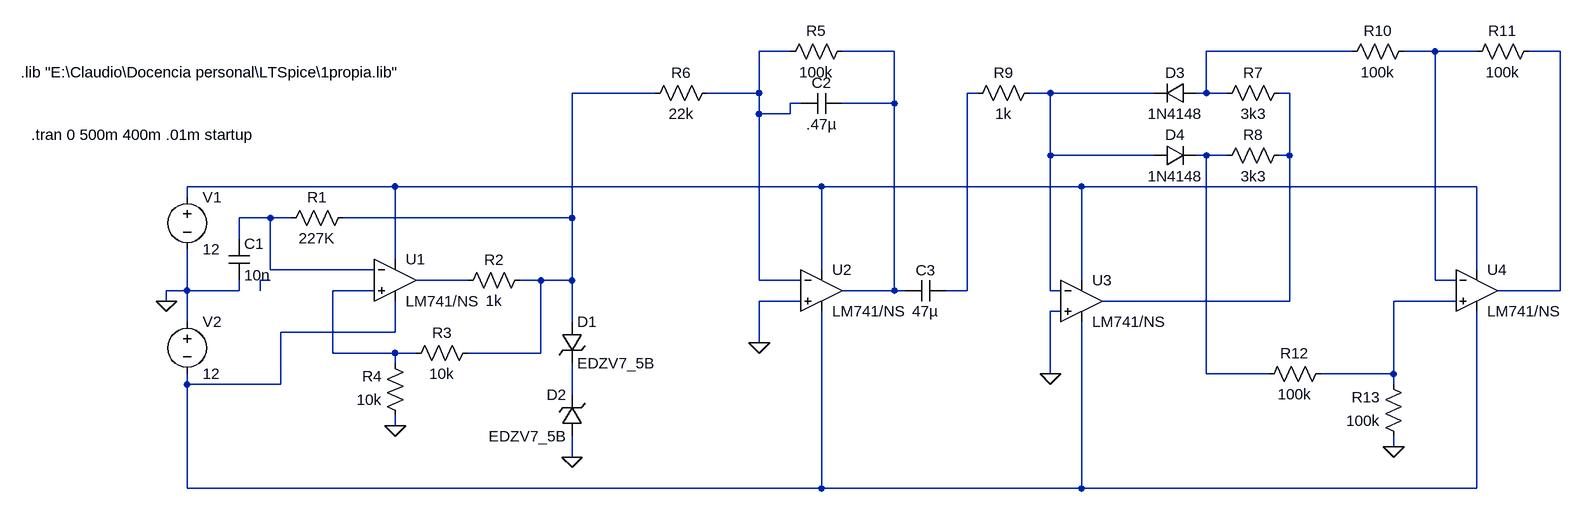
[diagram p0: schematic lab_amp_opx.asc]
lab_amp_opx.asc, the LTspice schematic file:
Version 4
SHEET 1 2016 680
WIRE 816 -176 768 -176
WIRE 976 -176 896 -176
WIRE 1680 -176 1456 -176
WIRE 1808 -176 1760 -176
WIRE 1872 -176 1808 -176
WIRE 2000 -176 1952 -176
WIRE 608 -112 480 -112
WIRE 768 -112 768 -176
WIRE 768 -112 688 -112
WIRE 1104 -112 1088 -112
WIRE 1216 -112 1184 -112
WIRE 1376 -112 1216 -112
WIRE 1456 -112 1456 -176
WIRE 1456 -112 1440 -112
WIRE 1488 -112 1456 -112
WIRE 1584 -112 1568 -112
WIRE 832 -96 816 -96
WIRE 976 -96 976 -176
WIRE 976 -96 896 -96
WIRE 768 -80 768 -112
WIRE 816 -80 816 -96
WIRE 816 -80 768 -80
WIRE 1216 -16 1216 -112
WIRE 1376 -16 1216 -16
WIRE 1456 -16 1440 -16
WIRE 1488 -16 1456 -16
WIRE 1584 -16 1584 -112
WIRE 1584 -16 1568 -16
WIRE 208 32 -112 32
WIRE 864 32 208 32
WIRE 1264 32 864 32
WIRE 1872 32 1264 32
WIRE -112 48 -112 32
WIRE 16 80 -32 80
WIRE 48 80 16 80
WIRE 480 80 480 -112
WIRE 480 80 128 80
WIRE -32 112 -32 80
WIRE 208 144 208 32
WIRE 16 160 16 80
WIRE 176 160 16 160
WIRE 864 160 864 32
WIRE 1872 160 1872 32
WIRE 16 176 0 176
WIRE 320 176 240 176
WIRE 432 176 400 176
WIRE 480 176 480 80
WIRE 480 176 432 176
WIRE 768 176 768 -80
WIRE 832 176 768 176
WIRE 1264 176 1264 32
WIRE 1808 176 1808 -176
WIRE 1840 176 1808 176
WIRE -112 192 -112 128
WIRE -112 192 -144 192
WIRE -32 192 -32 176
WIRE -32 192 -112 192
WIRE 0 192 0 176
WIRE 176 192 112 192
WIRE 976 192 976 -96
WIRE 976 192 896 192
WIRE 992 192 976 192
WIRE 1088 192 1088 -112
WIRE 1088 192 1056 192
WIRE 1216 192 1216 -16
WIRE 1232 192 1216 192
WIRE 2000 192 2000 -176
WIRE 2000 192 1904 192
WIRE -144 208 -144 192
WIRE 832 208 768 208
WIRE 1584 208 1584 -16
WIRE 1584 208 1296 208
WIRE 1840 208 1744 208
WIRE 1232 224 1216 224
WIRE -112 240 -112 192
WIRE 480 240 480 176
WIRE 208 256 208 208
WIRE 208 256 32 256
WIRE 768 272 768 208
WIRE 112 288 112 192
WIRE 208 288 112 288
WIRE 240 288 208 288
WIRE 432 288 432 176
WIRE 432 288 320 288
WIRE 208 304 208 288
WIRE 1216 320 1216 224
WIRE 1456 320 1456 -16
WIRE 1552 320 1456 320
WIRE 1744 320 1744 208
WIRE 1744 320 1632 320
WIRE -112 336 -112 320
WIRE 32 336 32 256
WIRE 32 336 -112 336
WIRE 1744 336 1744 320
WIRE 480 352 480 304
WIRE 208 400 208 384
WIRE 1744 432 1744 416
WIRE 480 448 480 416
WIRE -112 496 -112 336
WIRE 864 496 864 224
WIRE 864 496 -112 496
WIRE 1264 496 1264 240
WIRE 1264 496 864 496
WIRE 1872 496 1872 224
WIRE 1872 496 1264 496
FLAG -144 208 0
FLAG 208 400 0
FLAG 480 448 0
FLAG 768 272 0
FLAG 1216 320 0
FLAG 1744 432 0
SYMBOL voltage -112 32 R0
WINDOW 123 0 0 Left 2
WINDOW 39 0 0 Left 2
SYMATTR InstName V1
SYMATTR Value 12
SYMBOL voltage -112 224 R0
WINDOW 123 0 0 Left 2
WINDOW 39 0 0 Left 2
SYMATTR InstName V2
SYMATTR Value 12
SYMBOL res 144 64 R90
WINDOW 0 0 56 VBottom 2
WINDOW 3 32 56 VTop 2
SYMATTR InstName R1
SYMATTR Value 227K
SYMBOL res 336 272 R90
WINDOW 0 0 56 VBottom 2
WINDOW 3 32 56 VTop 2
SYMATTR InstName R3
SYMATTR Value 10k
SYMBOL res 224 400 R180
WINDOW 0 36 76 Left 2
WINDOW 3 36 40 Left 2
SYMATTR InstName R4
SYMATTR Value 10k
SYMBOL cap -48 112 R0
SYMATTR InstName C1
SYMATTR Value 10n
SYMBOL zener 464 240 R0
SYMATTR InstName D1
SYMATTR Value EDZV7_5B
SYMBOL zener 496 416 R180
WINDOW 0 24 64 Left 2
WINDOW 3 24 0 Left 2
SYMATTR InstName D2
SYMATTR Value EDZV7_5B
SYMBOL cap 896 -112 R90
WINDOW 0 0 32 VBottom 2
WINDOW 3 32 32 VTop 2
SYMATTR InstName C2
SYMATTR Value .47µ
SYMBOL res 912 -192 R90
WINDOW 0 0 56 VBottom 2
WINDOW 3 32 56 VTop 2
SYMATTR InstName R5
SYMATTR Value 100k
SYMBOL res 704 -128 R90
WINDOW 0 0 56 VBottom 2
WINDOW 3 32 56 VTop 2
SYMATTR InstName R6
SYMATTR Value 22k
SYMBOL res 416 160 R90
WINDOW 0 0 56 VBottom 2
WINDOW 3 32 56 VTop 2
SYMATTR InstName R2
SYMATTR Value 1k
SYMBOL Opamps\\opamp2 208 112 R0
SYMATTR InstName U1
SYMATTR Value LM741/NS
SYMBOL Opamps\\opamp2 864 128 R0
SYMATTR InstName U2
SYMATTR Value LM741/NS
SYMBOL Opamps\\opamp2 1264 144 R0
SYMATTR InstName U3
SYMATTR Value LM741/NS
SYMBOL Opamps\\opamp2 1872 128 R0
SYMATTR InstName U4
SYMATTR Value LM741/NS
SYMBOL res 1472 -96 R270
WINDOW 0 32 56 VTop 2
WINDOW 3 0 56 VBottom 2
SYMATTR InstName R7
SYMATTR Value 3k3
SYMBOL res 1472 0 R270
WINDOW 0 32 56 VTop 2
WINDOW 3 0 56 VBottom 2
SYMATTR InstName R8
SYMATTR Value 3k3
SYMBOL res 1088 -96 R270
WINDOW 0 32 56 VTop 2
WINDOW 3 0 56 VBottom 2
SYMATTR InstName R9
SYMATTR Value 1k
SYMBOL diode 1440 -128 R90
WINDOW 0 0 32 VBottom 2
WINDOW 3 32 32 VTop 2
SYMATTR InstName D3
SYMATTR Value 1N4148
SYMBOL diode 1376 0 R270
WINDOW 0 32 32 VTop 2
WINDOW 3 0 32 VBottom 2
SYMATTR InstName D4
SYMATTR Value 1N4148
SYMBOL res 1776 -192 R90
WINDOW 0 0 56 VBottom 2
WINDOW 3 32 56 VTop 2
SYMATTR InstName R10
SYMATTR Value 100k
SYMBOL res 1968 -192 R90
WINDOW 0 0 56 VBottom 2
WINDOW 3 32 56 VTop 2
SYMATTR InstName R11
SYMATTR Value 100k
SYMBOL res 1648 304 R90
WINDOW 0 0 56 VBottom 2
WINDOW 3 32 56 VTop 2
SYMATTR InstName R12
SYMATTR Value 100k
SYMBOL res 1760 432 R180
WINDOW 0 36 76 Left 2
WINDOW 3 36 40 Left 2
SYMATTR InstName R13
SYMATTR Value 100k
SYMBOL cap 1056 176 R90
WINDOW 0 0 32 VBottom 2
WINDOW 3 32 32 VTop 2
SYMATTR InstName C3
SYMATTR Value 47µ
TEXT -352 -48 Left 2 !.tran 0 500m 400m .01m startup
TEXT -368 -144 Left 2 !.lib "E:\\Claudio\\Docencia personal\\LTSpice\\1propia.lib"

The netlist it stands for:
* lab_amp_opx.asc
V1 N011 0 12
V2 0 N017 12
R1 N006 N012 227K
R3 N006 N015 10k
R4 0 N015 10k
C1 N012 0 10n
D1 N006 N018 EDZV7_5B
D2 0 N018 EDZV7_5B
C2 N002 N001 .47µ
R5 N002 N001 100k
R6 N001 N006 22k
R2 N006 N014 1k
XU1 N015 N012 N011 N017 N014 LM741/NS  ; pins In+ In- V+ V- OUT
XU2 0 N001 N011 N017 N002 LM741/NS  ; pins In+ In- V+ V- OUT
XU3 0 N008 N011 N017 N009 LM741/NS  ; pins In+ In- V+ V- OUT
XU4 N016 N004 N011 N017 N005 LM741/NS  ; pins In+ In- V+ V- OUT
R7 N003 N009 3k3
R8 N010 N009 3k3
R9 N007 N008 1k
D3 N003 N008 1N4148
D4 N008 N010 1N4148
R10 N004 N003 100k
R11 N005 N004 100k
R12 N016 N010 100k
R13 0 N016 100k
C3 N007 N002 47µ
.model D D
.lib standard.dio
.tran 0 500m 400m .01m startup
.lib "E:\Claudio\Docencia personal\LTSpice\1propia.lib"
.backanno
.end